# EAGLE design Mind-Synchronizing-Generator-PinHdrPotX-etch (EAGLE 7.2.0)
Analoger Wellenmustergenerator mit 3 (trippel-Fünf) 555 Timer.
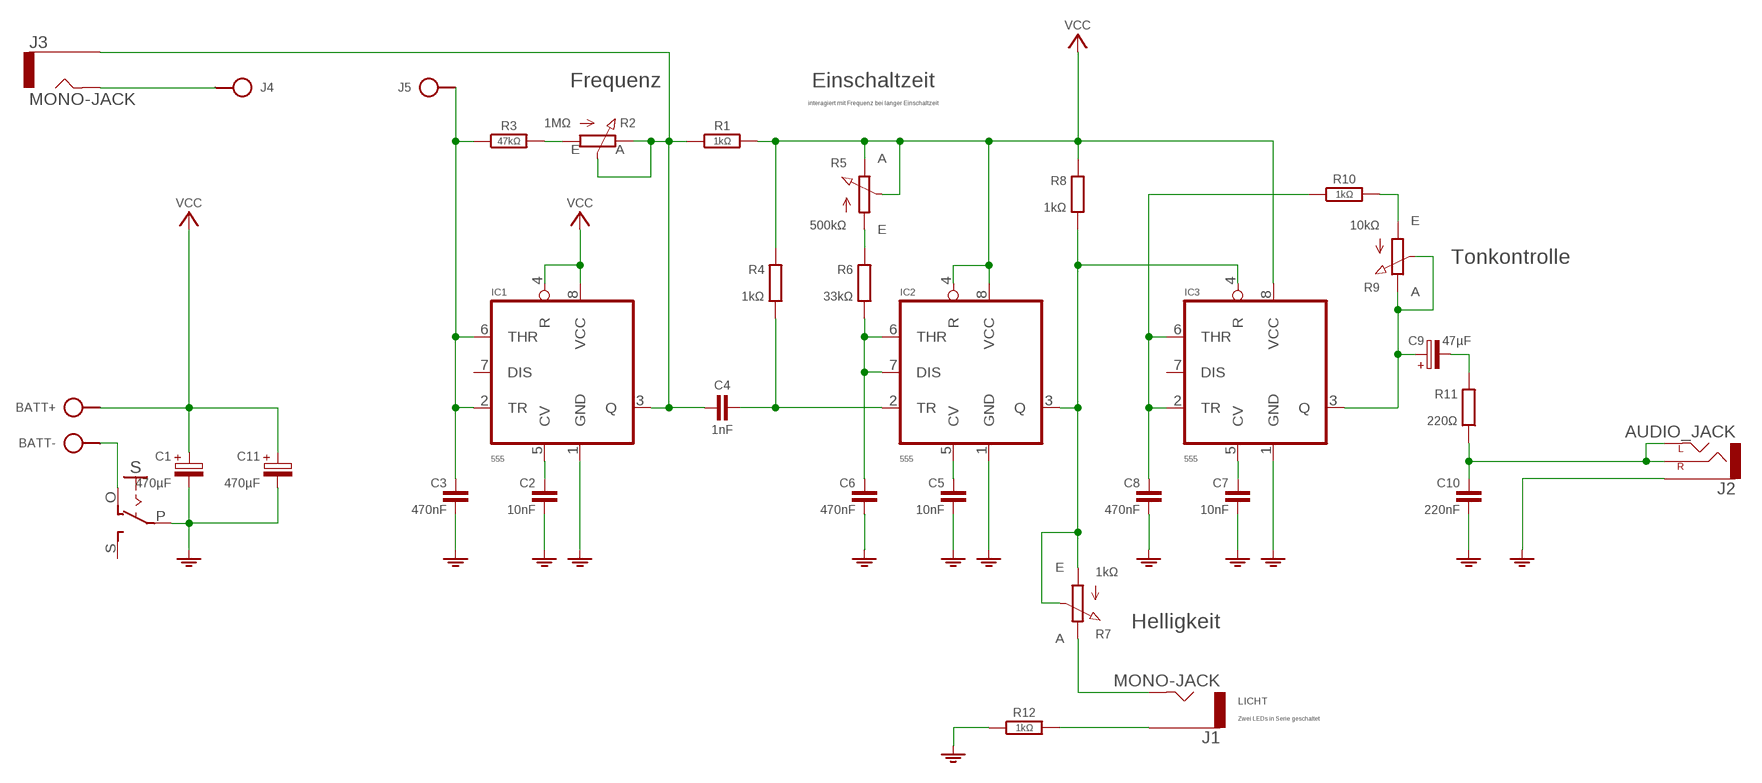
[diagram p0: schematic, sheet 1]

## Parts
BATT  SPAD+--+  [SPAD-+]
C1  470µF  CPOLE2.5-6  [E2,5-6]
C2  10nF  C050-020X044  [C050-020X044]
C3  470nF  C050-040X075  [C050-040X075]
C4  1nF  C-H050-020X044  [C050-020X044]
C5  10nF  C050-020X044/V  [C050-020X044/V]
C6  470nF  C050-040X075  [C050-040X075]
C7  10nF  C075-020X044/V  [C075-020X044/V]
C8  470nF  C050-040X075  [C050-040X075]
C9  47µF  CPOL-HE2,5-4  [E2,5-4]
C10  220nF  C025-025X060  [C050-025X060]
C11  470µF  CPOLE2.5-6  [E2,5-6]
IC1  555  555_ALT2-LBL  [555-DIL]
IC2  555  555_ALT2-LBL  [555-DIL]
IC3  555  555_ALT2-LBL  [555-DIL]
J1  MONO-JACK  [STEREOJACK2.5MM_STEREOJACK2.5MM]
J2  AUDIO_JACK  [AUDIO-JACK]
J3  MONO-JACK  [STEREOJACK2.5MM_STEREOJACK2.5MM]
J4  HPORT  [SPAD]
J5  HPORT  [SPAD]
R1  1kΩ  R-H0204/10  [0204/10]
R2  1MΩ  POT-H-3P  [CONN-3P]
R3  47kΩ  R-H0204/10  [0204/10]
R4  1kΩ  R0204/10-V  [0204/10-V]
R5  500kΩ  POT-3P  [CONN-3P]
R6  33kΩ  R0204/10  [0204/10]
R7  1kΩ  POT-3P-S1  [CONN-3P]
R8  1kΩ  R0204/10-V  [0204/10-V]
R9  10kΩ  POT-3P  [CONN-3P]
R10  1kΩ  R-H0204/10  [0204/10]
R11  220Ω  R0204/10-V  [0204/10-V]
R12  1kΩ  R-H0204/10  [0204/10]
S  SL-SW-1P-2T-H  [SLSW-1P2T-H]

## Nets
GND: C1.- C2.2 C3.2 C5.2 C6.2 C7.2 C8.2 C10.2 C11.- IC1.1(GND) IC2.1(GND) IC3.1(GND) J2.SLEEVE R12.1 S.P
LED_A: J1.TIP(LEFT) R7.3(E)
LED_K: J1.SHIELD(SLEEVE) R12.2
N$1: C5.1 IC2.5(CV)
N$2: BATT.1 S.O
N$5: C4.2 IC2.2(TR) R4.2
N$7: C2.1 IC1.5(CV)
N$8: R5.1(A) R6.1
N$9: C6.1 IC2.6(THR) IC2.7(DIS) R6.2
N$10: R9.1(A) R10.2
N$11: R2.1(A) R3.2
N$12: C8.1 IC3.2(TR) IC3.6(THR) R10.1
N$15: C9.- R11.1
N$16: C10.1 J2.RING(RIGHT) J2.TIP(LEFT) R11.2
N$17: C7.1 IC3.5(CV)
PRB: C3.1 IC1.2(TR) IC1.6(THR) J5.1 R3.1
PRB2: J3.TIP(LEFT) J4.1
Q1: C4.1 IC1.3(Q) J3.SHIELD(SLEEVE) R1.1 R2.2(S) R2.3(E)
Q2: IC2.3(Q) IC3.4(R) R7.1(S) R7.2(A) R8.2
Q3: C9.+ IC3.3(Q) R9.2(S) R9.3(E)
VCC: BATT.2 C1.+ C11.+ IC1.4(R) IC1.8(VCC) IC2.4(R) IC2.8(VCC) IC3.8(VCC) R1.2 R4.1 R5.2(S) R5.3(E) R8.1
Unconnected: IC1.7(DIS) IC3.7(DIS) S.S

## Notes on the sheet
- Frequenz | Einschaltzeit
- interagiert mit Frequenz bei langer Einschaltzeit
- Tonkontrolle
- Helligkeit
- LICHT
- Zwei LEDs in Serie geschaltet

## Library data of the parts
BATT = pad:SPAD+-
C1 C11 = c:CPOL: POLARIZED CAPACITOR, European symbol
C2 C3 C5-C8 C10 = c:C: CAPACITOR, European symbol
C4 = c:C-H
C9 = c:CPOL-H
IC1-IC3 = ic:*555_ALT2
J1 J3 = pad:MONO-JACK
J2 = pad:AUDIO_JACK
J4 J5 = pad:HPORT
R1 R3 R10 R12 = r:R-H
R2 = r:POT-H
R4 R6 R8 R11 = r:R: RESISTOR, European symbol
R5 R7 R9 = r:POT
S = sw:SL-SW-1P-2T

## Board
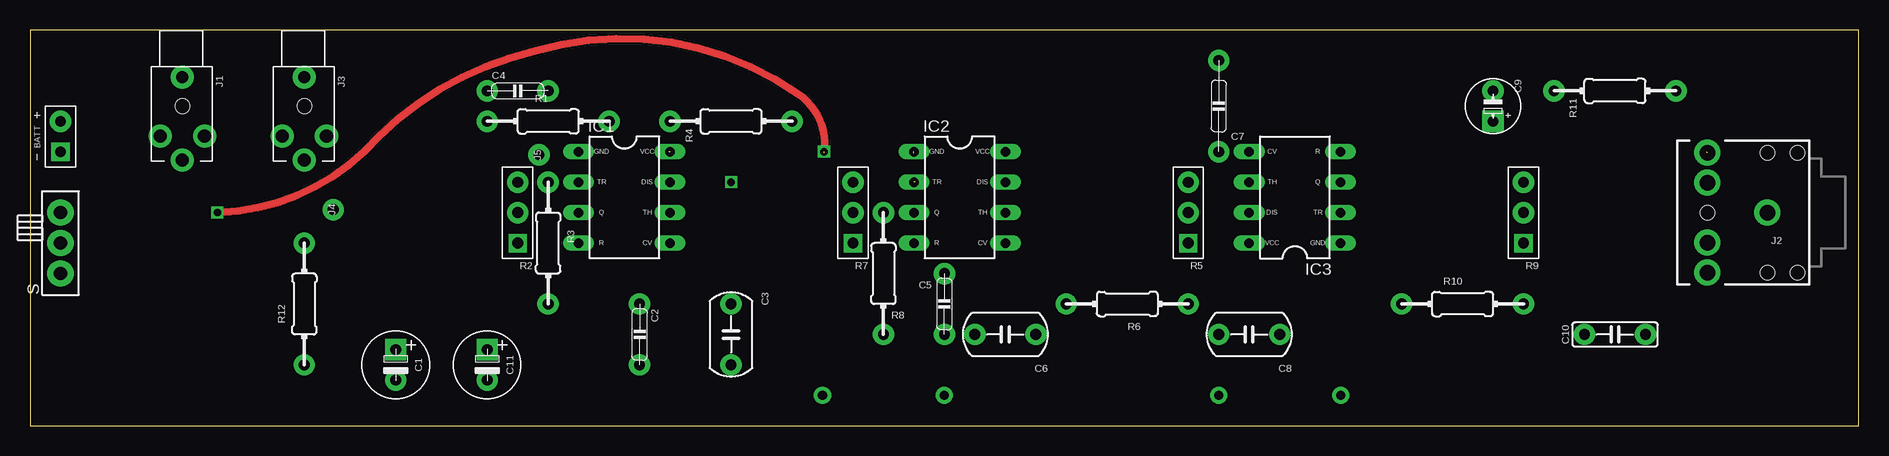
[diagram p1: board, top side]
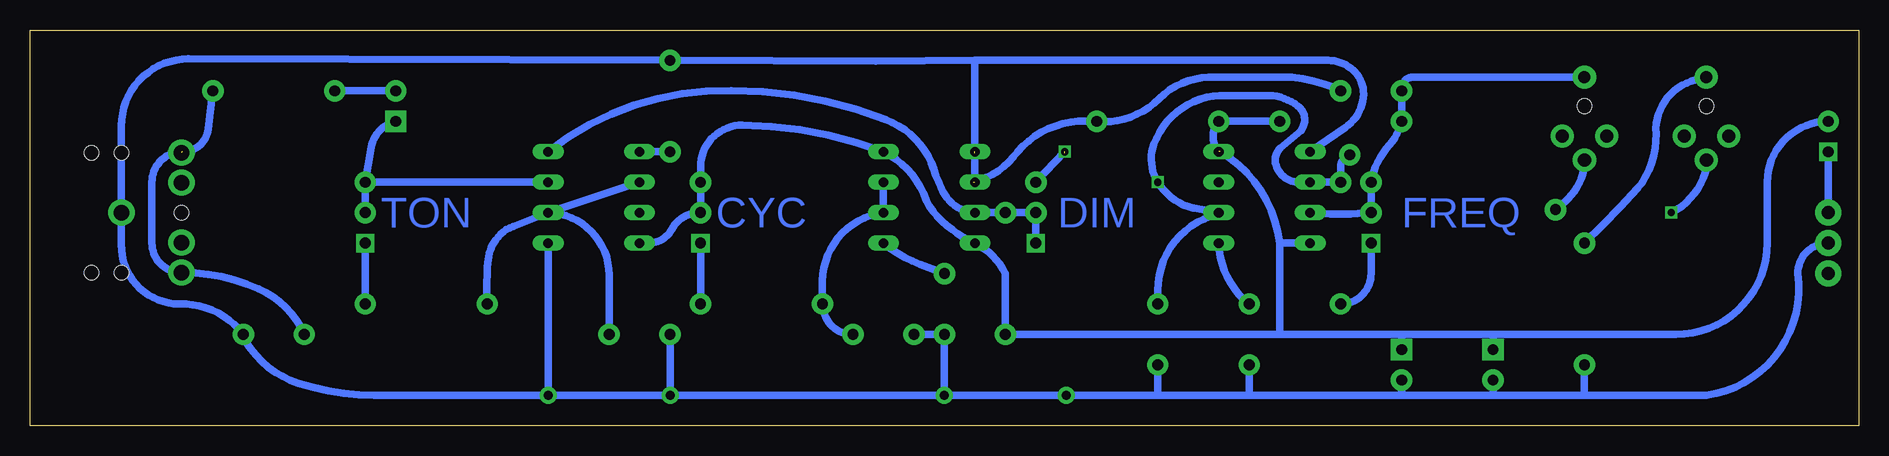
[diagram p2: board, bottom side, seen from below]

Size 152.4 x 33.02 mm. Coordinates in mm from the lower left corner, seen from the top.
Outline: 0,0 152.4,0 152.4,33.02 0,33.02 0,0
Copper layers (1*16): Top 0.035mm / dielectric 1.5mm / Bottom 0.035mm
Design rules "default": minimum track width 10mil, minimum drill 24mil, track to track 8mil, track to pad 8mil, pad to pad 8mil, via to via 8mil, smd to smd 8mil, copper to edge 40mil, drill to drill 8mil, minimum pad ring 10mil, minimum via ring 8mil, stop-mask expansion 4mil, vias tented up to drill 0mil, thermal gap 10mil

### Footprints (pad centres in the part's own frame; a part is rotated, then mirrored left to right if it is on the bottom)
SPAD-+ = drill 0.9 pad 1.524 square: 1 0,-1.27 | drill 0.9 pad 1.778: 2 0,1.27
E2,5-6 = drill 0.9 pad 1.778 square: + -1.27,0 | drill 0.9 pad 1.778: - 1.27,0
C050-020X044 = drill 0.9 pad 1.778: 1 -2.54,0; 2 2.54,0
C050-040X075 = drill 0.9 pad 1.778: 1 -2.54,0; 2 2.54,0
C050-020X044/V = drill 0.9 pad 1.778: 1 0,2.54; 2 0,-2.54
C075-020X044/V = drill 0.9 pad 1.778: 1 0,3.81; 2 0,-3.81
E2,5-4 = drill 0.9 pad 1.778 square: + 1.27,0 | drill 0.9 pad 1.778: - -1.27,0
C050-025X060 = drill 0.9 pad 1.778: 1 0,2.54; 2 0,-2.54
555-DIL = drill 0.8 pad 1.27 long: 1 -3.81,3.81; 2 -3.81,1.27; 3 -3.81,-1.27; 4 -3.81,-3.81; 5 3.81,-3.81; 6 3.81,-1.27; 7 3.81,1.27; 8 3.81,3.81
STEREOJACK2.5MM_STEREOJACK2.5MM = drill 1.1 pad 1.93: RING1 2.5,-1.85; RING2 2.5,1.85; TIP 4.5,0 | drill 1 pad 1.93: SHIELD -2.4,0 | hole 1.2: 0,0
AUDIO-JACK = drill 1.3 pad 2.184: RING 5,5; RSH 5,2.5; SLEEVE 0,0; TIP 5,-5; TSH 5,-2.5 | hole 1.2: 0,5; -2.5,5; -2.5,-5; 0,-5; 5,0
SPAD = drill 0.9 pad 1.778: 1 0,0
0204/10 = drill 0.9 pad 1.778: 1 -5.08,0; 2 5.08,0
CONN-3P = drill 0.9 pad 1.524 square: 1 0,2.54 | drill 0.9 pad 1.778: 2 0,0; 3 0,-2.54
0204/10-V = drill 0.9 pad 1.778: 1 0,5.08; 2 0,-5.08
SLSW-1P2T-H = drill 1.1 pad 2.184: O 2.54,0; P 0,0; S -2.54,0

### Placement (x,y rotation side)
BATT  2.54,24.13 0 top
C1  30.48,5.08 270 top
C2  50.8,7.62 270 top
C3  58.42,7.62 270 top
C4  40.64,27.94 0 top
C5  76.2,10.16 0 top
C6  81.28,7.62 180 top
C7  99.06,26.67 180 top
C8  101.6,7.62 180 top
C9  121.92,26.67 270 top
C10  132.08,7.62 90 top
C11  38.1,5.08 270 top
IC1  49.53,19.05 0 top
IC2  77.47,19.05 0 top
IC3  105.41,19.05 180 top
J1  12.7,26.67 270 top
J2  144.78,17.78 180 top
J3  22.86,26.67 270 top
J4  25.27,18.03 0 top
J5  42.42,22.61 0 top
R1  43.18,25.4 0 top
R2  40.64,17.78 180 top
R3  43.18,15.24 270 top
R4  58.42,25.4 90 top
R5  96.52,17.78 180 top
R6  91.44,10.16 180 top
R7  68.58,17.78 180 top
R8  71.12,12.7 180 top
R9  124.46,17.78 180 top
R10  119.38,10.16 0 top
R11  132.08,27.94 90 top
R12  22.86,10.16 90 top
S  2.54,15.24 90 top

### Tracks (layer width: path | path; a pad name or v marks a point on that pad's centre or on a via)
GND  (via drill 0.76 pad 1.42)  (1 unrouted)
  Bottom 0.61: 58.42,2.54 50.8,2.54 | 50.8,2.54 38.1,2.54 | 38.1,2.54 30.48,2.54 | 30.48,2.54 22.86,2.54 | 22.86,2.54 12.7,2.54 arc-90 5.08,12.7 arc90 S.P | v76.2,2.54 v66.04,2.54 58.42,2.54 | v76.2,2.54 v99.06,2.54 | v99.06,2.54 v109.22,2.54 | IC3.1 v109.22,2.54 | C8.2 v99.06,2.54 | v76.2,2.54 C5.2 C6.2 | 73.66,30.48 81.92,30.43 C7.2 139.19,30.61 arc-90 144.78,25.02 J2.SLEEVE arc-4 144.78,15.11 arc-91 139.95,10.16 arc54 C10.2 134.75,7.62 arc-45 130.05,3.56 arc-18 123.7,2.54 v109.22,2.54 | 73.66,30.48 44.2,30.48 arc34 42.55,29.97 arc60 41.27,27.69 arc56 42.8,24.89 IC1.1 45.85,22.86 45.85,22.73 | IC2.1 73.66,20.32 | 73.66,22.73 73.66,30.48 | 58.42,2.54 C3.2 | C2.2 50.8,2.54 | R12.1 22.86,2.54 | C1.- 30.48,2.54 | C11.- 38.1,2.54
LED_A  (via drill 0.6)  (1 unrouted)
  Top 0.61: v15.62,17.78 arc47 29.08,24.13 arc-32 42.04,31.24 arc-52 64.01,27.69 arc-64 66.17,22.73
  Bottom 0.61: J1.TIP 12.57,22.1 arc56 v15.62,17.78 | v66.17,22.86 R7.3
LED_K
  Bottom 0.61: R12.2 arc-4 18.41,19.81 arc-40 16.89,24.38 arc71 14.35,28.57 arc13 J1.SHIELD
N$1
  Bottom 0.61: C5.1 arc1 78.23,13.46 arc18 IC2.5
N$2
  Bottom 0.61: BATT.1 S.O
N$3  (via drill 0.6)
  other vias: 58.42,20.32
N$5  (1 unrouted)
  Bottom 0.61: C4.2 43.69,28.19 arc-17 47.24,29.08 53.59,29.08 arc-47 58.29,27.3 arc51 R4.2 63.75,25.4 arc-55 70.1,22.86 arc40 73.79,20.32
N$7
  Bottom 0.61: IC1.5 arc-50 C2.1
N$8
  Bottom 0.61: R6.1 R5.1
N$9
  Bottom 0.61: C6.1 arc90 R6.2 86.36,12.06 arc82 IC2.6 IC2.7
N$10
  Bottom 0.61: R10.2 R9.1
N$11
  Bottom 0.61: R2.1 40.64,12.7 arc90 R3.2
N$12
  Bottom 0.61: 114.43,10.16 R10.1 arc4 114.3,12.7 arc7 114.17,14.1 arc60 112.14,16.64 IC3.2 | IC3.2 109.47,17.65 | C8.1 104.14,12.57 arc-89 IC3.2 | IC3.6 IC3.2
N$15
  Bottom 0.61: R11.1 C9.-
N$16  (1 unrouted)
  Bottom 0.61: C10.1 arc-42 133.35,11.43 arc-24 139.7,12.78 J2.RING arc90 142.24,15.24 142.24,20.32 arc90 139.7,22.86 arc-83 137.54,24.77 arc-1 R11.2
N$17
  Bottom 0.61: IC3.5 C7.1
PRB
  Bottom 0.61: C3.1 58.42,11.3 arc77 53.34,17.65 53.34,17.91 arc90 IC1.6 55.44,18.16 55.5,18.16 arc44 58.42,20.32 arc51 58.74,23.5 arc72 52.7,27.56 49.15,27.56 arc37 46.74,26.67 arc90 46.48,24.64 48.19,23.18 arc-45 48.64,22.1 arc-90 46.35,20.32 IC1.2 R3.1 | 43.18,20.57 R3.1 | R3.1 43.18,21.59 arc74 J5.1
PRB2
  Bottom 0.61: J4.1 24.51,18.67 arc-50 J3.TIP
Q1
  Bottom 0.61: IC1.3 arc-10 R2.2 R2.3 arc30 39.37,23.11 arc-30 R1.1 C4.1 arc90 37.28,29.07 J3.SHIELD
Q2
  Bottom 0.61: R7.1 R7.2 R8.2 IC2.3 arc65 76.45,19.81 arc7 77.09,21.4 arc-52 81.09,25.53 arc-22 93.98,27.94 arc-40 IC3.4
Q3
  Bottom 0.61: R9.2 R9.3 | IC3.3 R9.3 | R9.3 123.95,23.24 arc67 C9.+
VCC  (1 unrouted)
  Bottom 0.61: 38.1,7.62 30.48,7.62 | 30.48,7.62 15.24,7.62 arc-90 7.62,15.24 7.62,20.32 arc90 BATT.2 | IC1.8 arc80 R4.1 R1.2 | R5.2 R5.3 96.52,21.59 arc90 93.03,25.08 arc20 IC2.8 arc46 77.72,18.8 arc-27 75.56,16.38 arc-17 IC2.4 arc37 71.12,12.7 R8.1 48.26,7.62 | 96.39,17.78 R5.2 | 53.21,22.86 arc53 48.26,15.24 | 38.1,7.62 48.26,7.62 | IC1.4 48.26,15.24 | 48.26,15.24 48.26,7.62 | C11.+ 38.1,7.62 | C1.+ 30.48,7.62 | IC3.8 100.84,15.24 arc-62 98.93,16.38 arc64 R5.2

### Text on the board
Bottom: FREQ | DIM | CYC | TON